# EAGLE design usbtinyisp_single (EAGLE 6.5.0)
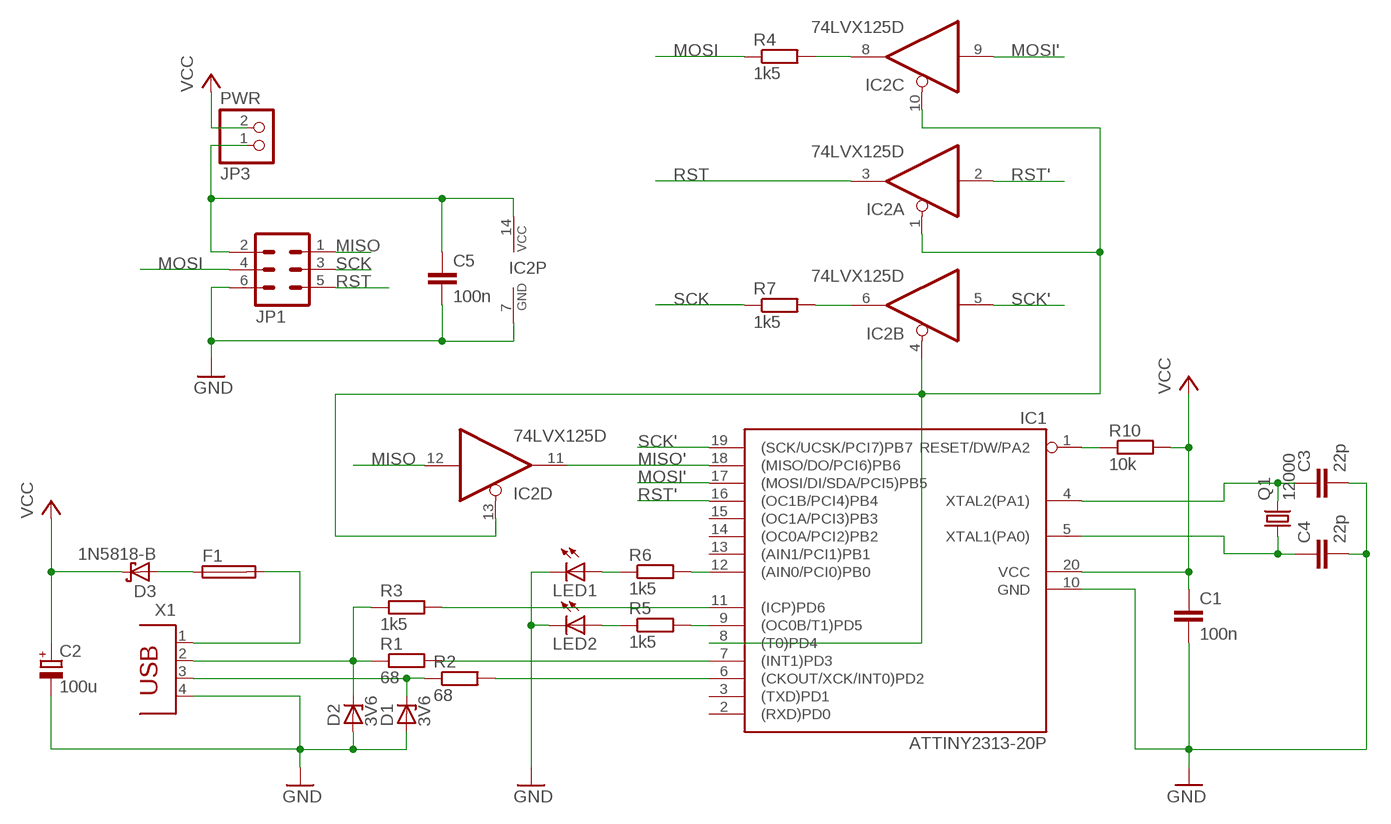
[diagram p0: schematic, sheet 1]

## Parts
C1  100n  C-EUC0805  [C0805]
C2  100u  CPOL-EUE2.5-6  [E2,5-6]
C3  22p  C-EUC1206  [C1206]
C4  22p  C-EUC1206  [C1206]
C5  100n  C-EUC0805  [C0805]
D1  3V6  ZENER-DIODESOD80C  [SOD80C]
D2  3V6  ZENER-DIODESOD80C  [SOD80C]
D3  1N5818-B  1N5817-B  [DO41-7.6]
F1  PTC-FUSE-LP60-050  [LP60-050]
IC1  ATTINY2313-20P  [DIL20]
IC2  74LVX125D  74HC125D  [SO14]
JP1  ML6  [ML6]
JP3  PWR  PINHD-1X2  [1X02]
LED1  LED3MM  [LED3MM]
LED2  LED3MM  [LED3MM]
Q1  12000  CRYSTALHC49U-V  [HC49U-V]
R1  68  R-EU_0207/10  [0207/10]
R2  68  R-EU_0207/10  [0207/10]
R3  1k5  R-EU_R0805  [R0805]
R4  1k5  R-EU_R0805  [R0805]
R5  1k5  R-EU_R0805  [R0805]
R6  1k5  R-EU_R0805  [R0805]
R7  1k5  R-EU_0207/10  [0207/10]
R10  10k  R-EU_R0805  [R0805]
X1  PN61729  [PN61729]

## Nets
GND [supply]: C1.2 C2.- C3.2 C4.2 C5.2 D1.A D2.A IC1.10(GND) IC2.7(P:GND) JP1.6 LED1.K(C) LED2.K(C) X1.4
MISO: IC2.12(D:I) JP1.1
MISO': IC1.18((MISO/DO/PCI6)PB6) IC2.11(D:O)
MOSI: JP1.4 R4.1
MOSI': IC1.17((MOSI/DI/SDA/PCI5)PB5) IC2.9(C:I)
N$1: D2.C R1.1 R3.1 X1.2
N$2: D1.C R2.1 X1.3
N$3: IC1.7((INT1)PD3) R1.2
N$5: LED1.A R6.1
N$6: IC1.6((CKOUT/XCK/INT0)PD2) R2.2
N$7: IC1.12((AIN0/PCI0)PB0) R6.2
N$9: IC1.1(RESET/DW/PA2) R10.1
N$10: IC1.9((OC0B/T1)PD5) R5.2
N$11: LED2.A R5.1
N$12: IC2.6(B:O) R7.2
N$13: IC2.8(C:O) R4.2
N$14 [supply]: D3.A F1.P$1
N$15: IC1.8((T0)PD4) IC2.1(A:OE) IC2.4(B:OE) IC2.10(C:OE) IC2.13(D:OE)
N$16: IC1.11((ICP)PD6) R3.2
RST: IC2.3(A:O) JP1.5
RST': IC1.16((OC1B/PCI4)PB4) IC2.2(A:I)
SCK: JP1.3 R7.1
SCK': IC1.19((SCK/UCSK/PCI7)PB7) IC2.5(B:I)
VBUS [supply]: F1.P$2 X1.1
VCC [supply]: C1.1 C2.+ D3.C IC1.20(VCC) JP3.2 R10.2
VTARGET [supply]: C5.1 IC2.14(P:VCC) JP1.2 JP3.1
XTAL1: C4.1 IC1.5(XTAL1(PA0)) Q1.1
XTAL2: C3.1 IC1.4(XTAL2(PA1)) Q1.2
Unconnected: IC1.2((RXD)PD0) IC1.3((TXD)PD1) IC1.13((AIN1/PCI1)PB1) IC1.14((OC0A/PCI2)PB2) IC1.15((OC1A/PCI3)PB3)

## Library data of the parts
C1 C3-C5 = rcl:C-EU: CAPACITOR, European symbol
C2 = rcl:CPOL-EU: POLARIZED CAPACITOR, European symbol
D1 D2 = diode:ZENER-DIODE: Z-Diode
D3 = diode:1N581*: 1.0A SCHOTTKY BARRIER RECTIFIER Source: http://www.diodes.com/datasheets/ds23001.pdf
F1 = n39:PTC-FUSE: PTC Fuses This device contains different PTC fuses in different packages. All are polymeric positive temperature coefficient devices (PPTC, commonly known as a resettable fuse, polyfuse or polyswitch). See Wikipedia <https://en.wikipedia.org/wiki/Resettable_fuse> for a full explanation. Reichelt Bestellnr. Package Datasheet PTC194600-??? SMD-1812 SIBA-194600.pdf PTC194700-??? SMD-2920 – PFRA ??? radial LP60_?.pdf
IC1 = avr:ATTINY2313: MICROCONTROLLER 2 Kbytes FLASH 128 bytes SRAM 128 bytes EEPROM USART USI
IC2 = 74xx-eu:74*125: Quad bus BUFFER, 3-state
JP1 = con-ml:ML6: HARTING; OC_FARNELL: unknown; OC_NEWARK: unknown
JP3 = pinhead:PINHD-1X2: PIN HEADER
LED1 LED2 = minimidi:LED: LED OSRAM: - CHIPLED LG R971, LG N971, LY N971, LG Q971, LY Q971, LO R971, LY R971 LH N974, LH R974 LS Q976, LO Q976, LY Q976 LO Q996 - Hyper CHIPLED LW Q18S LB Q993, LB Q99A, LB R99A - SideLED LS A670, LO A670, LY A670, LG A670, LP A670 LB A673, LV A673, LT A673, LW A673 LH A674 LY A675 LS A676, LA A676, LO A676, LY A676, LW A676 LS A679, LY A679, LG A679 - Hyper Micro SIDELED® LS Y876, LA Y876, LO Y876, LY Y876 LT Y87S - SmartLED LW L88C, LW L88S LB L89C, LB L89S, LG L890 LS L89K, LO L89K, LY L89K LS L896, LA L896, LO L896, LY L896 - TOPLED LS T670, LO T670, LY T670, LG T670, LP T670 LSG T670, LSP T670, LSY T670, LOP T670, LYG T670 LG T671, LOG T671, LSG T671 LB T673, LV T673, LT T673, LW T673 LH T674 LS T676, LA T676, LO T676, LY T676, LB T676, LH T676, LSB T676, LW T676 LB T67C, LV T67C, LT T67C, LS T67K, LO T67K, LY T67K, LW E67C LS E67B, LA E67B, LO E67B, LY E67B, LB E67C, LV E67C, LT E67C LW T67C LS T679, LY T679, LG T679 LS T770, LO T770, LY T770, LG T770, LP T770 LB T773, LV T773, LT T773, LW T773 LH T774 LS E675, LA E675, LY E675, LS T675 LS T776, LA T776, LO T776, LY T776, LB T776 LHGB T686 LT T68C, LB T68C - Hyper Mini TOPLED® LB M676 - Mini TOPLED Santana® LG M470 LS M47K, LO M47K, LY M47K Source: http://www.osram.convergy.de/
Q1 = crystal:CRYSTAL: CRYSTAL; OC_FARNELL: 1666969; OC_NEWARK: unknown
R1-R7 R10 = rcl:R-EU_: RESISTOR, European symbol
X1 = con-berg-ez:PN61729: BERG USB connector

## Net classes
0 default: width 0.305 mm
1 supply: width 0.406 mm

## Board
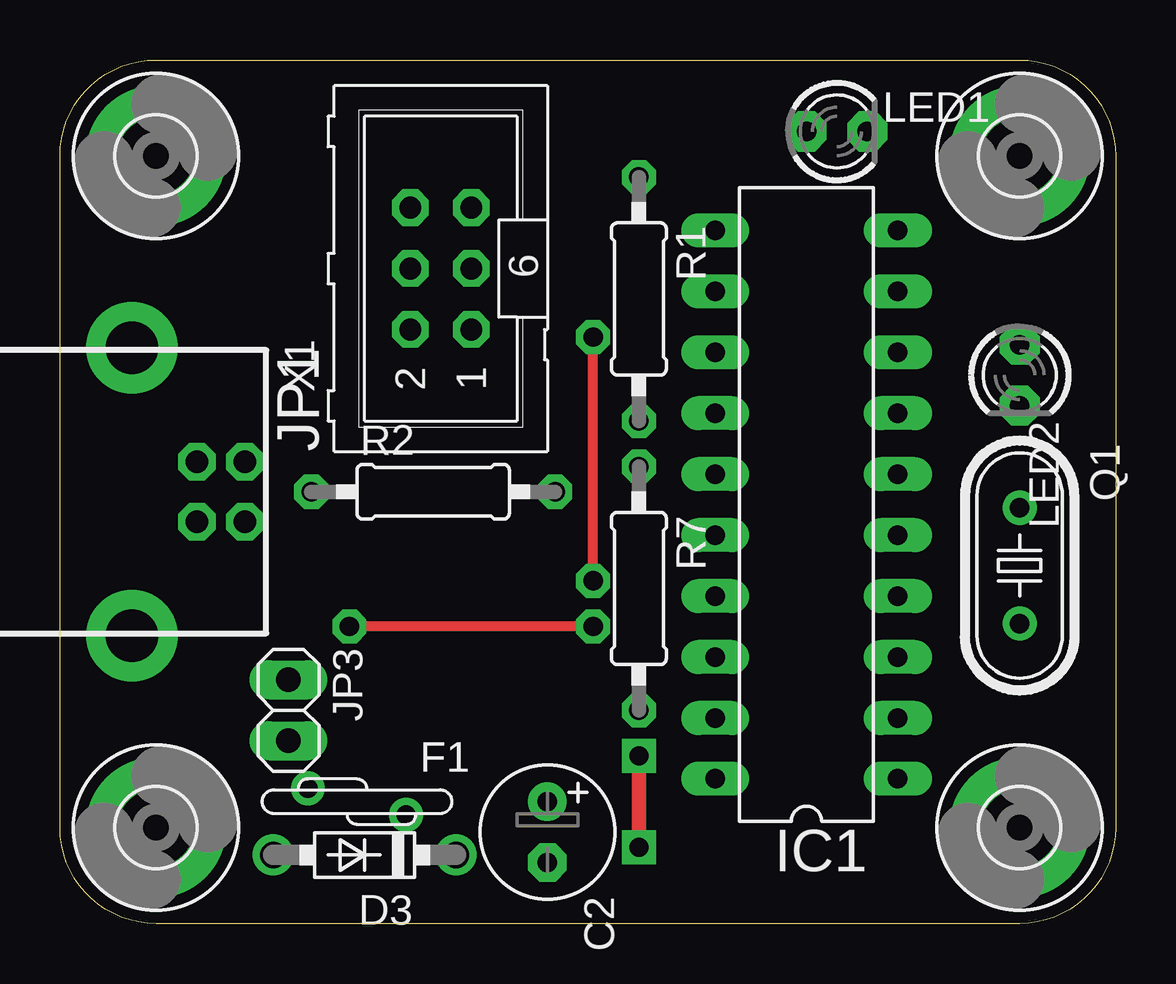
[diagram p1: board, top side]
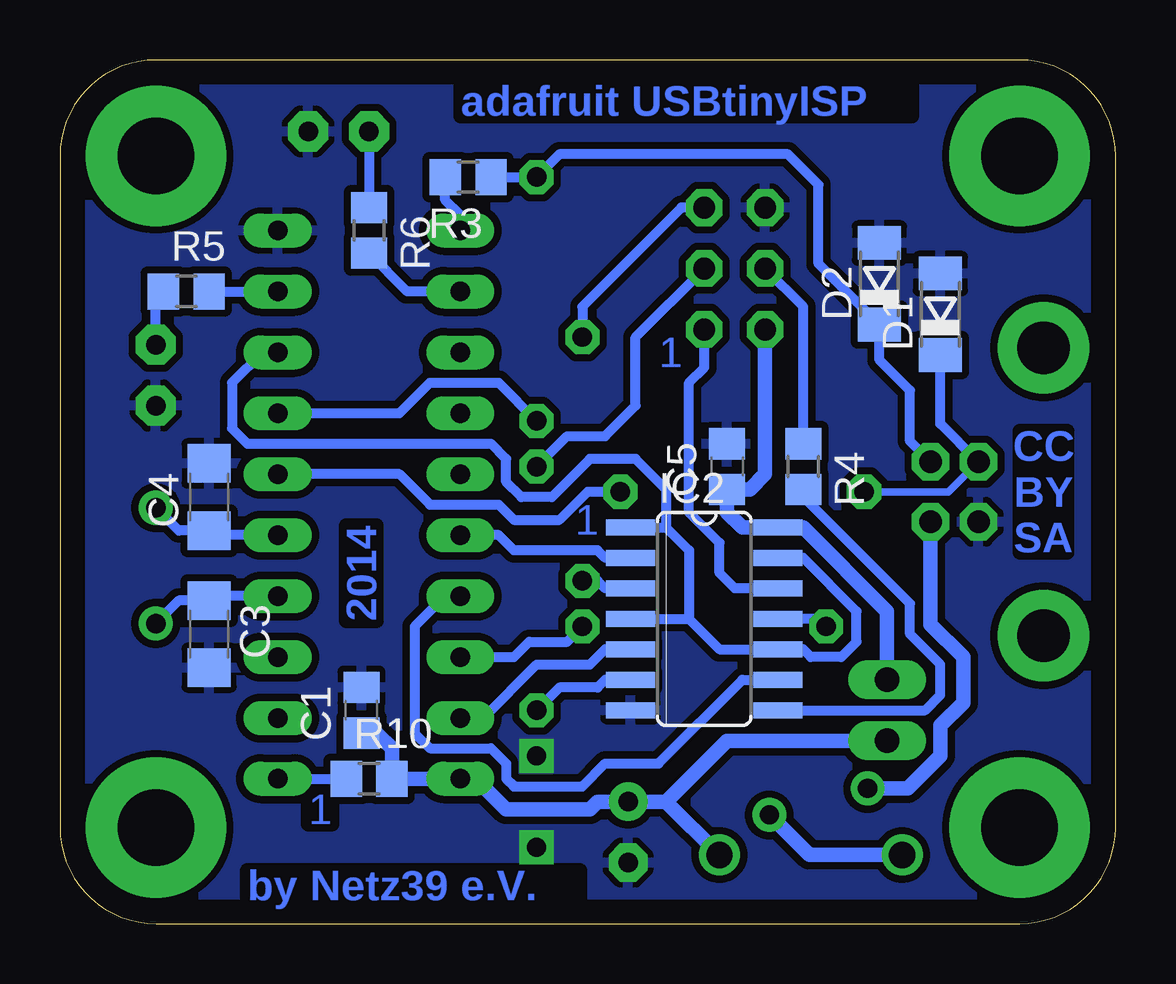
[diagram p2: board, bottom side, seen from below]

Size 44 x 36 mm. Coordinates in mm from the lower left corner, seen from the top.
Outline: 4,36 40,36 arc-90 44,32 44,4 arc-90 40,0 4,0 arc-90 0,4 0,32 arc-90 4,36
Copper layers (1*16): Top 0.035mm / dielectric 1.5mm / Bottom 0.035mm
Design rules "default *": minimum track width 12mil, minimum drill 0.8mm, track to track 12mil, track to pad 12mil, pad to pad 12mil, via to via 12mil, smd to smd 0mil, copper to edge 40mil, drill to drill 8mil, minimum pad ring 12mil, minimum via ring 12mil, stop-mask expansion 4mil, vias tented up to drill 0mil, thermal gap 10mil

### Footprints (pad centres in the part's own frame; a part is rotated, then mirrored left to right if it is on the bottom)
C0805 = smd 1.3 x 1.5: 1 -0.95,0; 2 0.95,0
E2,5-6 = drill 0.813 pad 1.6: + -1.27,0 | drill 0.813 pad 1.6 octagon: - 1.27,0
C1206 = smd 1.6 x 1.8: 1 -1.4,0; 2 1.4,0
SOD80C = smd 1.4 x 1.8: A 1.7,0; C -1.7,0
DO41-7.6 = drill 1.1 pad 1.7: A 3.81,0; C -3.81,0
LP60-050 = drill 0.8: P$1 -2.05,0.55; P$2 2.05,-0.55
DIL20 = drill 0.813 long: 1 -11.43,-3.81; 2 -8.89,-3.81; 3 -6.35,-3.81; 4 -3.81,-3.81; 5 -1.27,-3.81; 6 1.27,-3.81; 7 3.81,-3.81; 8 6.35,-3.81; 9 8.89,-3.81; 10 11.43,-3.81; 11 11.43,3.81; 12 8.89,3.81; 13 6.35,3.81; 14 3.81,3.81; 15 1.27,3.81; 16 -1.27,3.81; 17 -3.81,3.81; 18 -6.35,3.81; 19 -8.89,3.81; 20 -11.43,3.81
SO14 = smd 0.66 x 2.032: 1 -3.81,-3.073; 2 -2.54,-3.073; 3 -1.27,-3.073; 4 0,-3.073; 5 1.27,-3.073; 6 2.54,-3.073; 7 3.81,-3.073; 8 3.81,3.073; 9 2.54,3.073; 10 1.27,3.073; 11 0,3.073; 12 -1.27,3.073; 13 -2.54,3.073; 14 -3.81,3.073
ML6 = drill 0.914 octagon: 1 -2.54,-1.27; 2 -2.54,1.27; 3 0,-1.27; 4 0,1.27; 5 2.54,-1.27; 6 2.54,1.27
1X02 = drill 1.016 long: 1 -1.27,0; 2 1.27,0
LED3MM = drill 0.813 pad 1.676 octagon: A -1.27,0; K 1.27,0
HC49U-V = drill 0.813: 1 -2.413,0; 2 2.413,0
0207/10 = drill 0.813 octagon: 1 -5.08,0; 2 5.08,0
R0805 = smd 1.3 x 1.5: 1 -0.95,0; 2 0.95,0
3,2-PAD = drill 3.2 pad 5.842: B3,2 0,0
PN61729 = drill 0.95 pad 1.575 octagon: 1 1.25,4.71; 2 -1.25,4.71; 3 -1.25,2.71; 4 1.25,2.71 | drill 2.2 pad 3.81: P$1 -6,0; P$2 6,0

### Placement (x,y rotation side)
C1  31.43,8.89 90 bottom
C2  20.32,3.81 270 top
C3  37.78,12.06 270 bottom
C4  37.78,17.78 90 bottom
C5  16.19,19.05 90 bottom
D1  7.3,25.4 90 bottom
D2  9.84,26.67 90 bottom
D3  12.7,2.86 180 top
F1  12.38,5.08 180 top
IC1  31.11,17.46 90 top
IC2  17.14,12.7 270 bottom
JP1  15.88,27.3 90 top
JP3  9.53,8.89 270 top
LED1  32.38,33.02 0 top
LED2  40.01,22.86 270 top
Q1  40.01,14.92 270 top
R1  24.13,26.04 270 top
R2  15.56,18 0 top
R3  26.99,31.11 180 bottom
R4  13.02,19.05 270 bottom
R5  38.73,26.35 0 bottom
R6  31.11,28.89 270 bottom
R7  24.13,13.97 270 top
R10  31.11,6.03 0 bottom
U$1  [3,2-PAD]  4,4 0 top
U$2  [3,2-PAD]  40,4 0 top
U$3  [3,2-PAD]  40,32 0 top
U$4  [3,2-PAD]  4,32 0 top
X1  3,18 270 top

### Tracks (layer width: path | path; a pad name or v marks a point on that pad's centre or on a via)
GND  (via drill 0.8)
  Top 0.61: v24.13,6.99 v24.13,3.17
  pour Bottom: 0,4 arc90 4,0 40,0 arc90 44,4 44,32 arc90 40,36 4,36 arc90 0,32
MISO
  Bottom 0.406: IC2.12 15.88,13.97 16.51,14.61 16.51,15.88 17.78,17.14 17.78,22.54 17.14,23.18 JP1.1
MISO'  (via drill 0.8)
  Top 0.406: v22.23,12.38 v12.06,12.38
  Bottom 0.406: v12.06,12.38 12.38,12.7 IC2.11 | IC1.18 25.08,11.11 24.45,11.75 22.86,11.75 v22.23,12.38
MOSI
  Bottom 0.406: R4.1 13.02,25.72 JP1.4
MOSI'
  Bottom 0.406: IC1.17 27.94,13.65 29.21,12.38 29.21,7.94 28.57,7.3 26.04,7.3 25.4,6.67 25.4,6.03 25.08,5.71 22.23,5.71 21.27,6.67 19.05,6.67 15.56,10.16 IC2.9
N$1
  Bottom 0.406: R3.1 R1.1 23.18,32.07 13.65,32.07 12.38,30.8 12.38,27.51 D2.C 9.84,23.5 8.57,22.23 8.57,20.11 X1.2
N$2
  Bottom 0.305: X1.3 6.96,18 R2.1
  Bottom 0.406: X1.3 7.3,20.84 D1.C
N$3
  Bottom 0.406: IC1.7 29.84,21.27 28.57,22.54 25.72,22.54 R1.2
N$5
  Bottom 0.406: LED1.A R6.1
N$6
  Bottom 0.406: IC1.6 29.84,18.73 28.57,17.46 25.72,17.46 25.08,16.83 23.18,16.83 22,18 R2.2
N$7
  Bottom 0.406: IC1.12 29.52,26.35 R6.2
N$9
  Bottom 0.406: IC1.1 R10.1
N$10
  Bottom 0.406: R5.2 IC1.9
N$11
  Bottom 0.406: LED2.A 40.01,26.03 R5.1
N$12
  Bottom 0.406: IC2.6 21.27,10.16 21.59,9.84 23.18,9.84 R7.2
N$13
  Bottom 0.406: IC2.8 7.94,8.89 7.3,9.53 7.3,10.79 8.57,12.06 8.57,13.34 13.02,17.78 R4.2
N$14
  Bottom 0.61: F1.P$1 12.76,2.86 D3.A
N$15
  Bottom 0.406: IC2.4 17.78,12.7 | 17.78,12.7 16.51,11.43 IC2.10 13.02,11.43 12.7,11.11 11.43,11.11 10.79,11.75 10.79,13.02 13.02,15.24 IC2.13 | IC2.1 18.73,16.51 | 18.73,16.51 17.78,15.56 17.78,12.7 | 18.73,16.51 18.73,18.1 20,19.37 21.91,19.37 23.5,17.78 24.77,17.78 25.4,18.41 25.4,19.37 26.04,20 36.2,20 36.83,20.64 36.83,22.54 35.56,23.81 IC1.8
N$16
  Bottom 0.406: IC1.11 27.3,29.53 27.94,30.16 R3.2
RST  (via drill 0.8)
  Top 0.406: v22.23,14.29 v22.23,24.45
  Bottom 0.406: IC2.3 21.27,13.97 21.59,14.29 v22.23,14.29 | JP1.5 18.1,29.84 22.23,25.72 v22.23,24.45
RST'
  Bottom 0.406: IC2.2 21.27,15.24 21.59,15.56 25.08,15.56 25.72,16.19 IC1.16
SCK
  Bottom 0.406: JP1.3 20,24.45 20,21.59 21.27,20.32 22.86,20.32 R7.1
SCK'
  Bottom 0.406: IC1.19 26.35,8.57 24.13,10.79 21.91,10.79 21.27,11.43 IC2.5
VBUS
  Bottom 0.61: X1.1 7.71,12.47 6.35,11.11 6.35,9.21 7.3,8.26 7.3,6.99 8.66,5.63 F1.P$2
VCC
  Bottom 0.61: 18.73,5.08 C2.+ 21.59,5.08 21.91,4.76 25.4,4.76 26.67,6.03 IC1.20 R10.2 30.16,7.3 30.8,7.94 C1.1 | 18.73,5.08 D3.C | JP3.2 16.19,7.62 18.73,5.08
VTARGET
  Bottom 0.61: JP3.1 9.53,13.02 13.02,16.51 IC2.14 15.56,16.51 16.19,17.14 C5.1 15.24,18.1 14.61,18.73 JP1.2
XTAL1
  Bottom 0.406: IC1.5 37.59,16.19 C4.1 39.05,16.38 Q1.1
XTAL2
  Bottom 0.406: IC1.4 37.59,13.65 C3.1 39.05,13.46 Q1.2

### Text on the board
Bottom: adafruit USBtinyISP | 1 | CC / BY / SA | 1 | 2014 | 1 | by Netz39 e.V.